# Altium schematic sheet Power_Invertor.SchDoc (part 1 of 2)
size 1200 x 800 mm; SheetNumber: 1; SheetTotal: 1
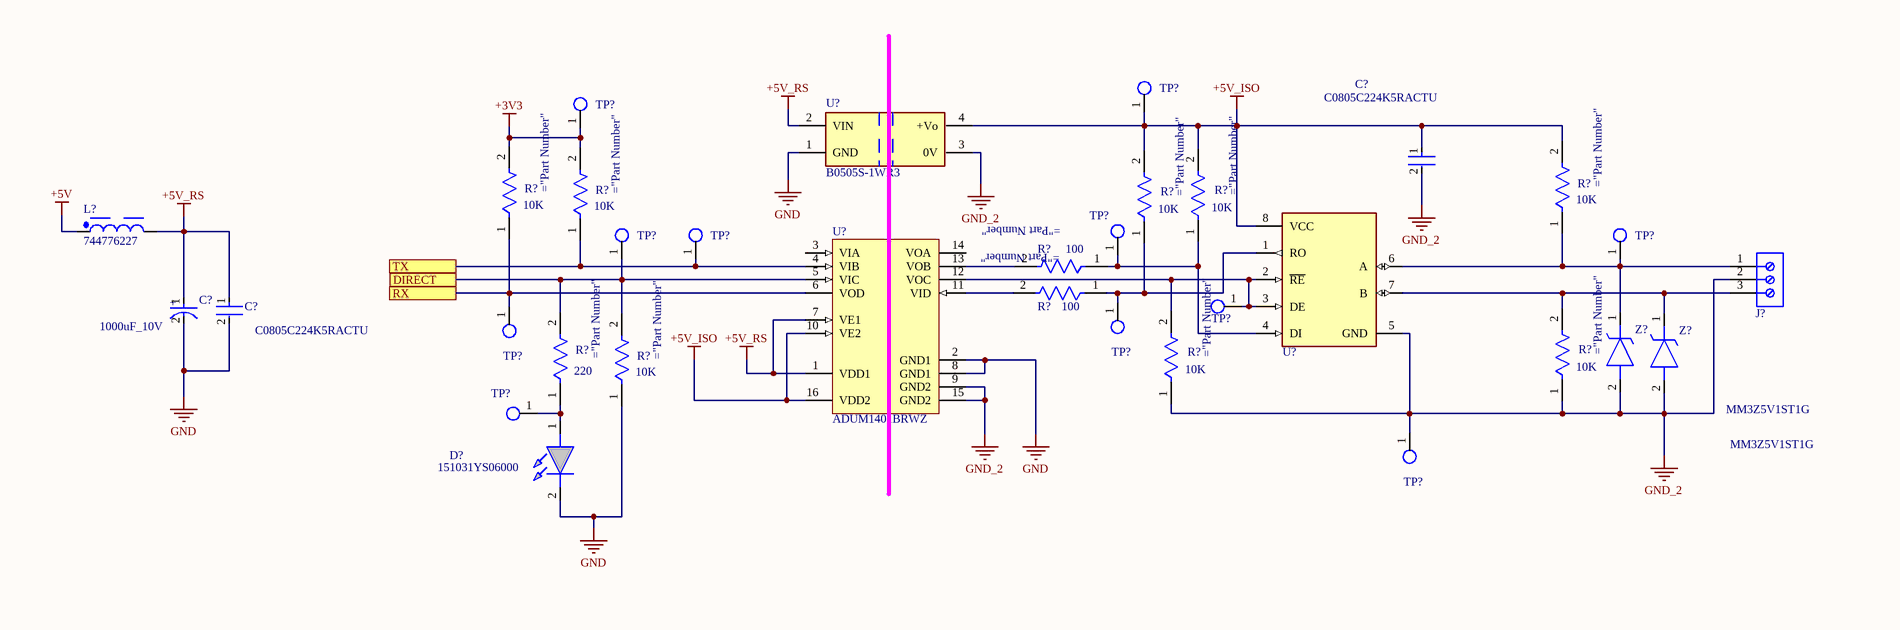
[diagram p0: Power_Invertor.SchDoc, top left]
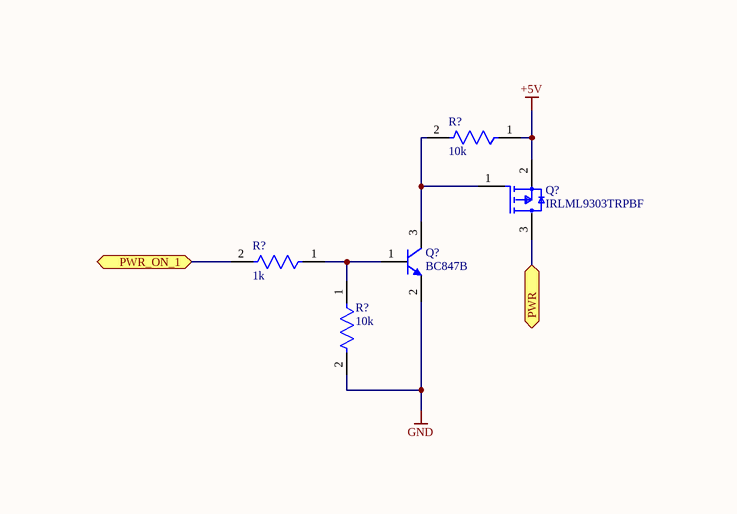
[diagram p1: Power_Invertor.SchDoc, top middle]
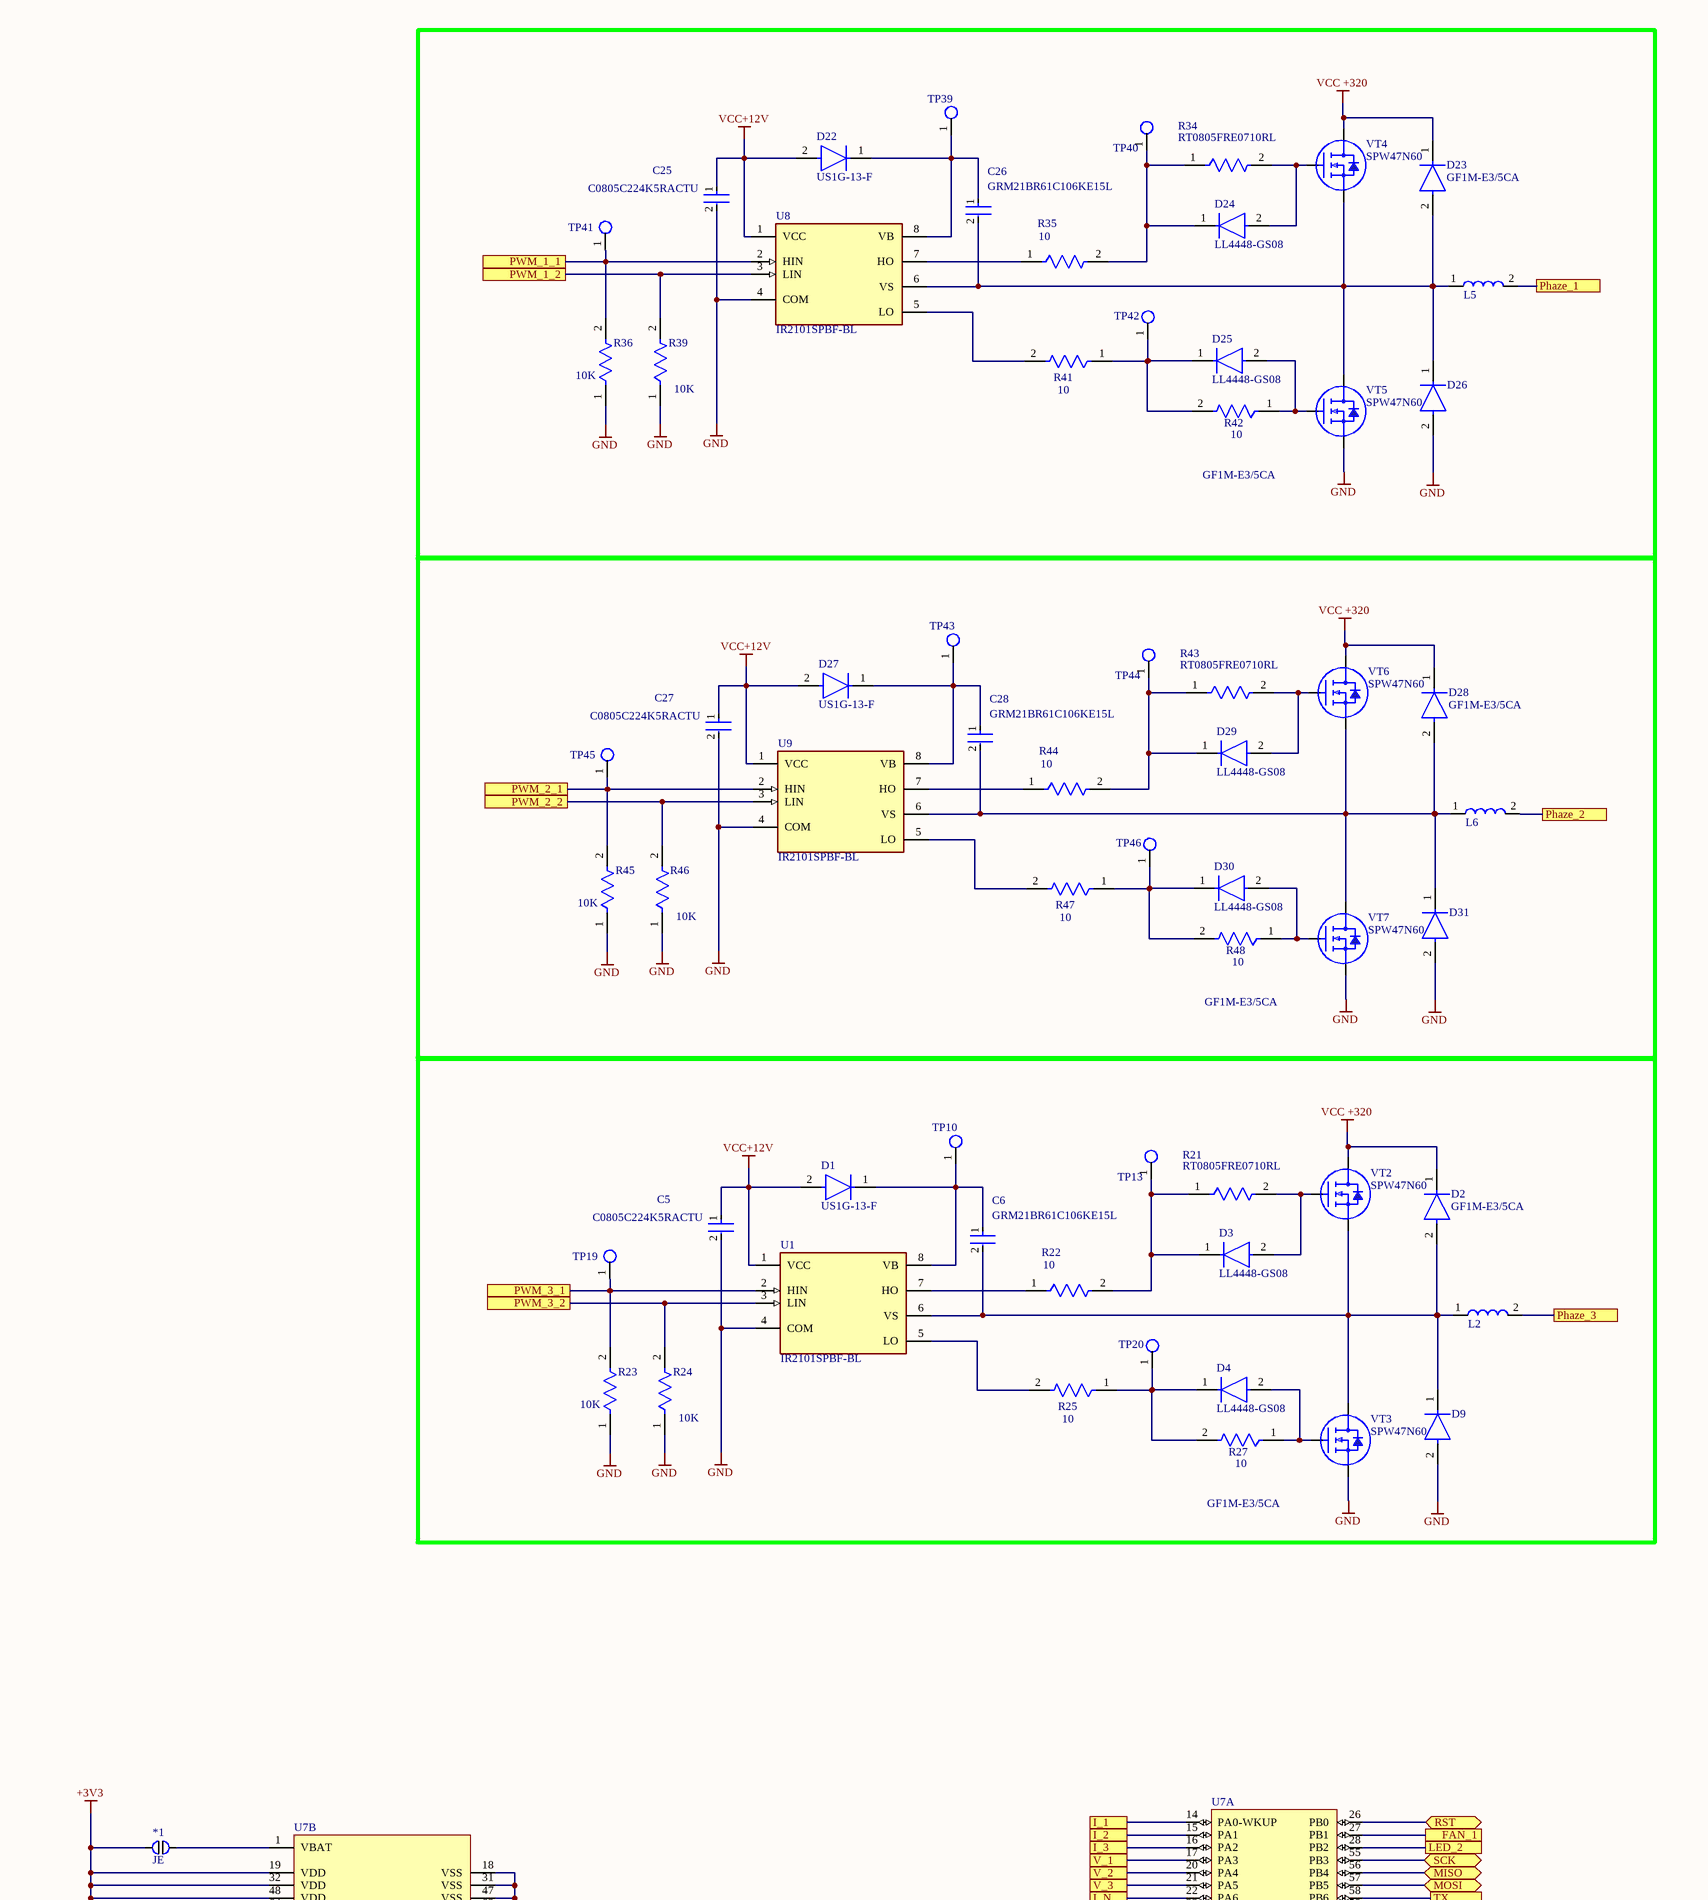
[diagram p2: Power_Invertor.SchDoc, top right]
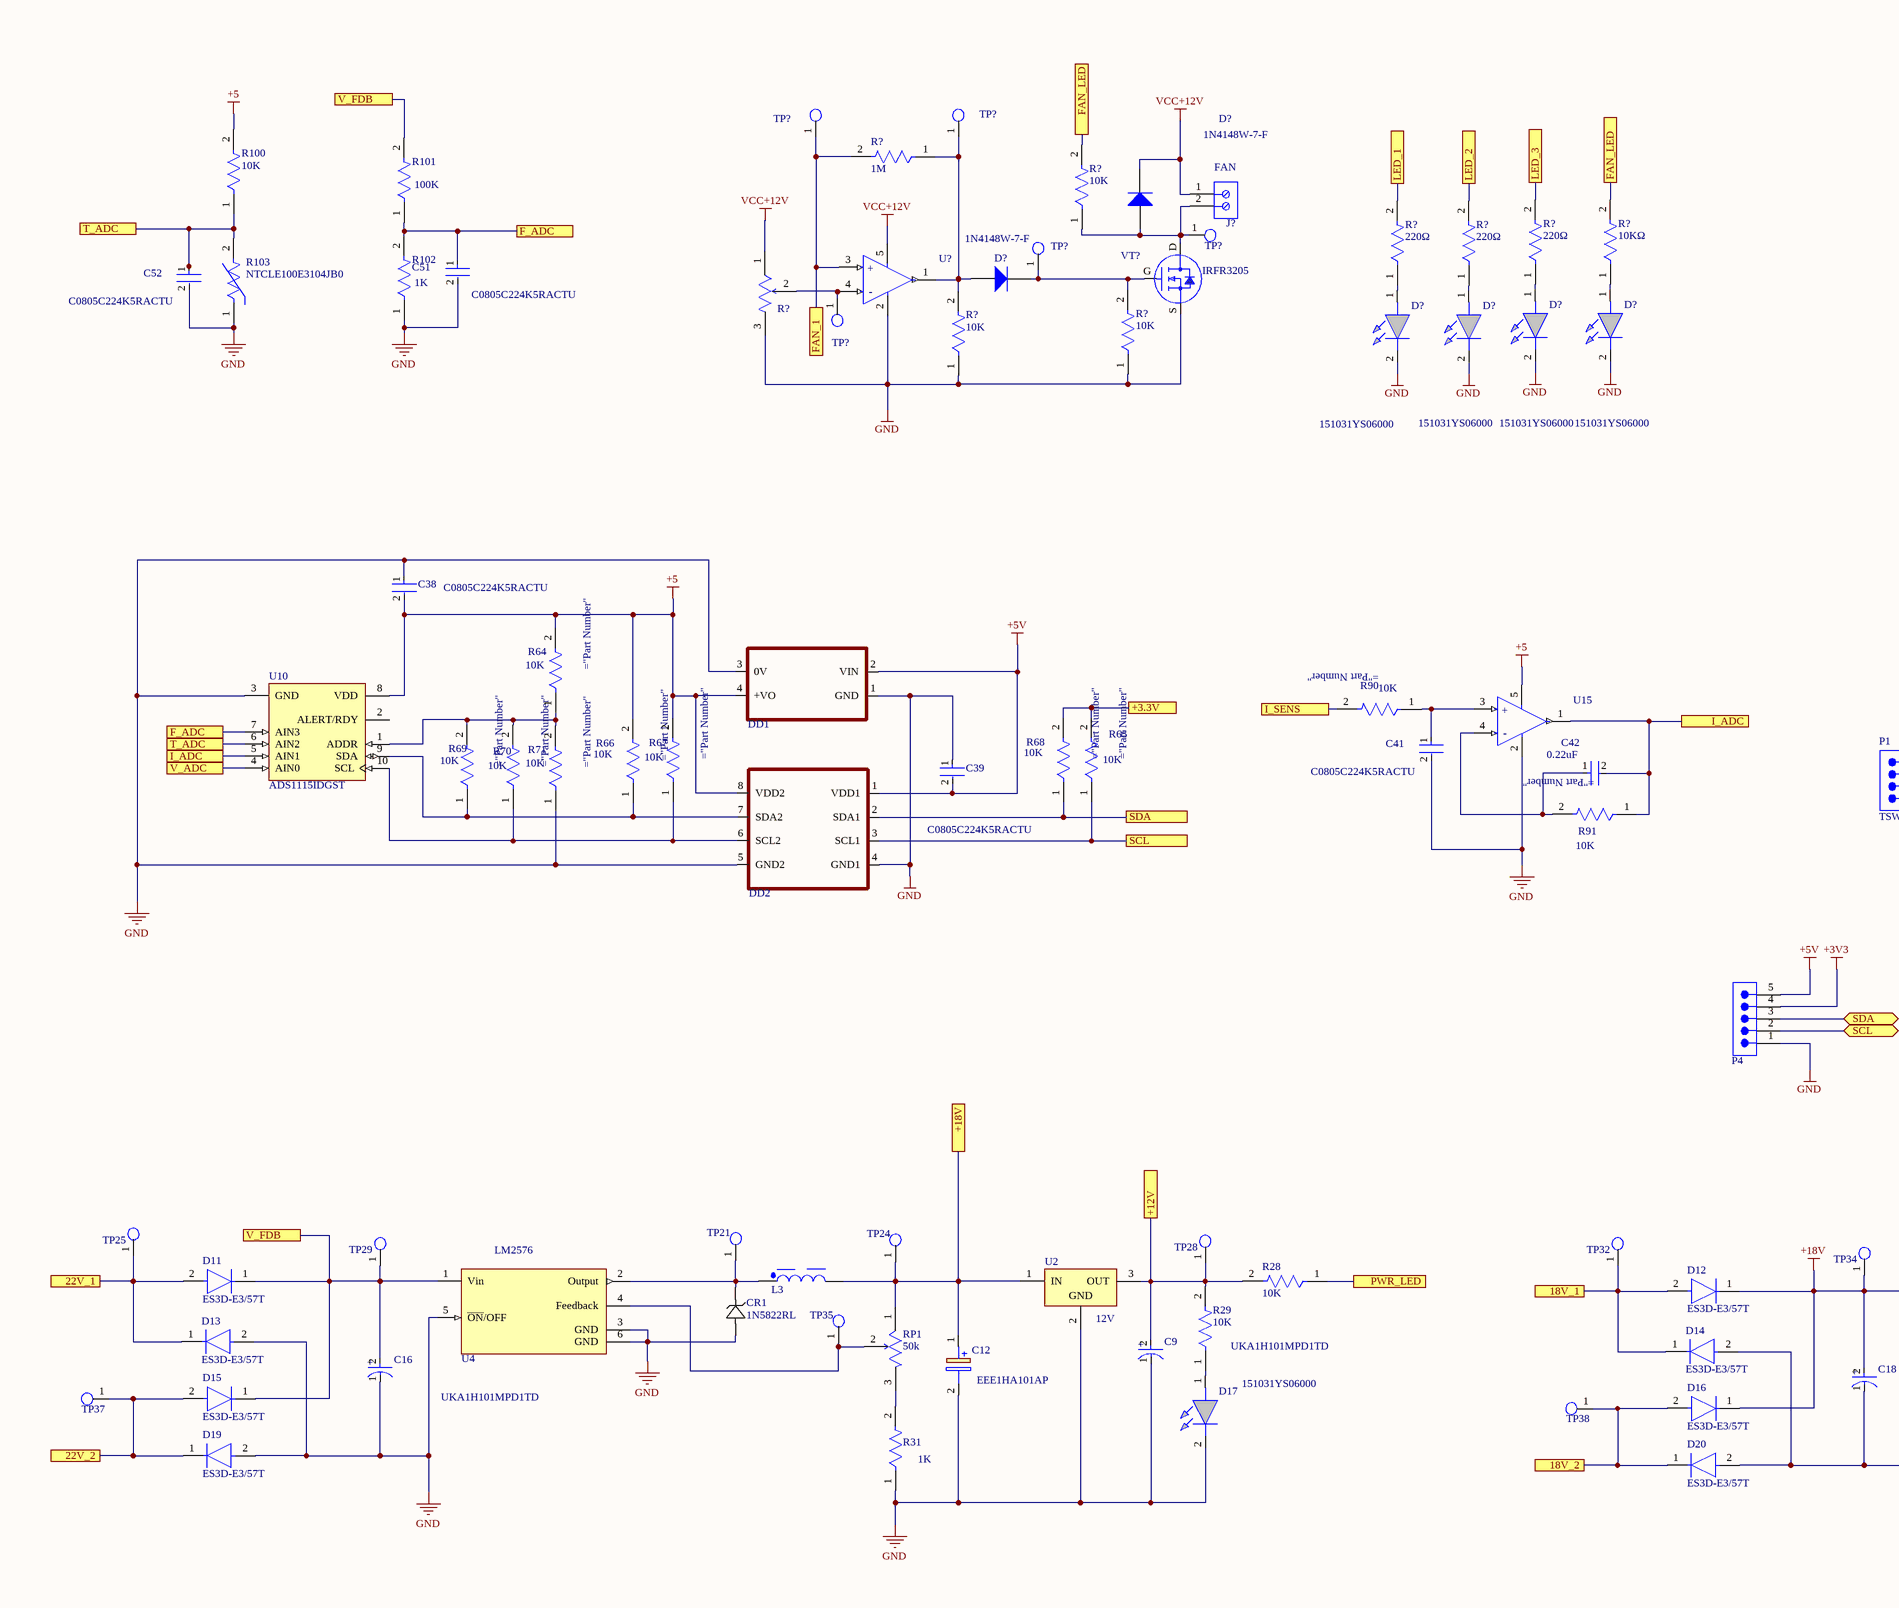
[diagram p3: Power_Invertor.SchDoc, bottom left]
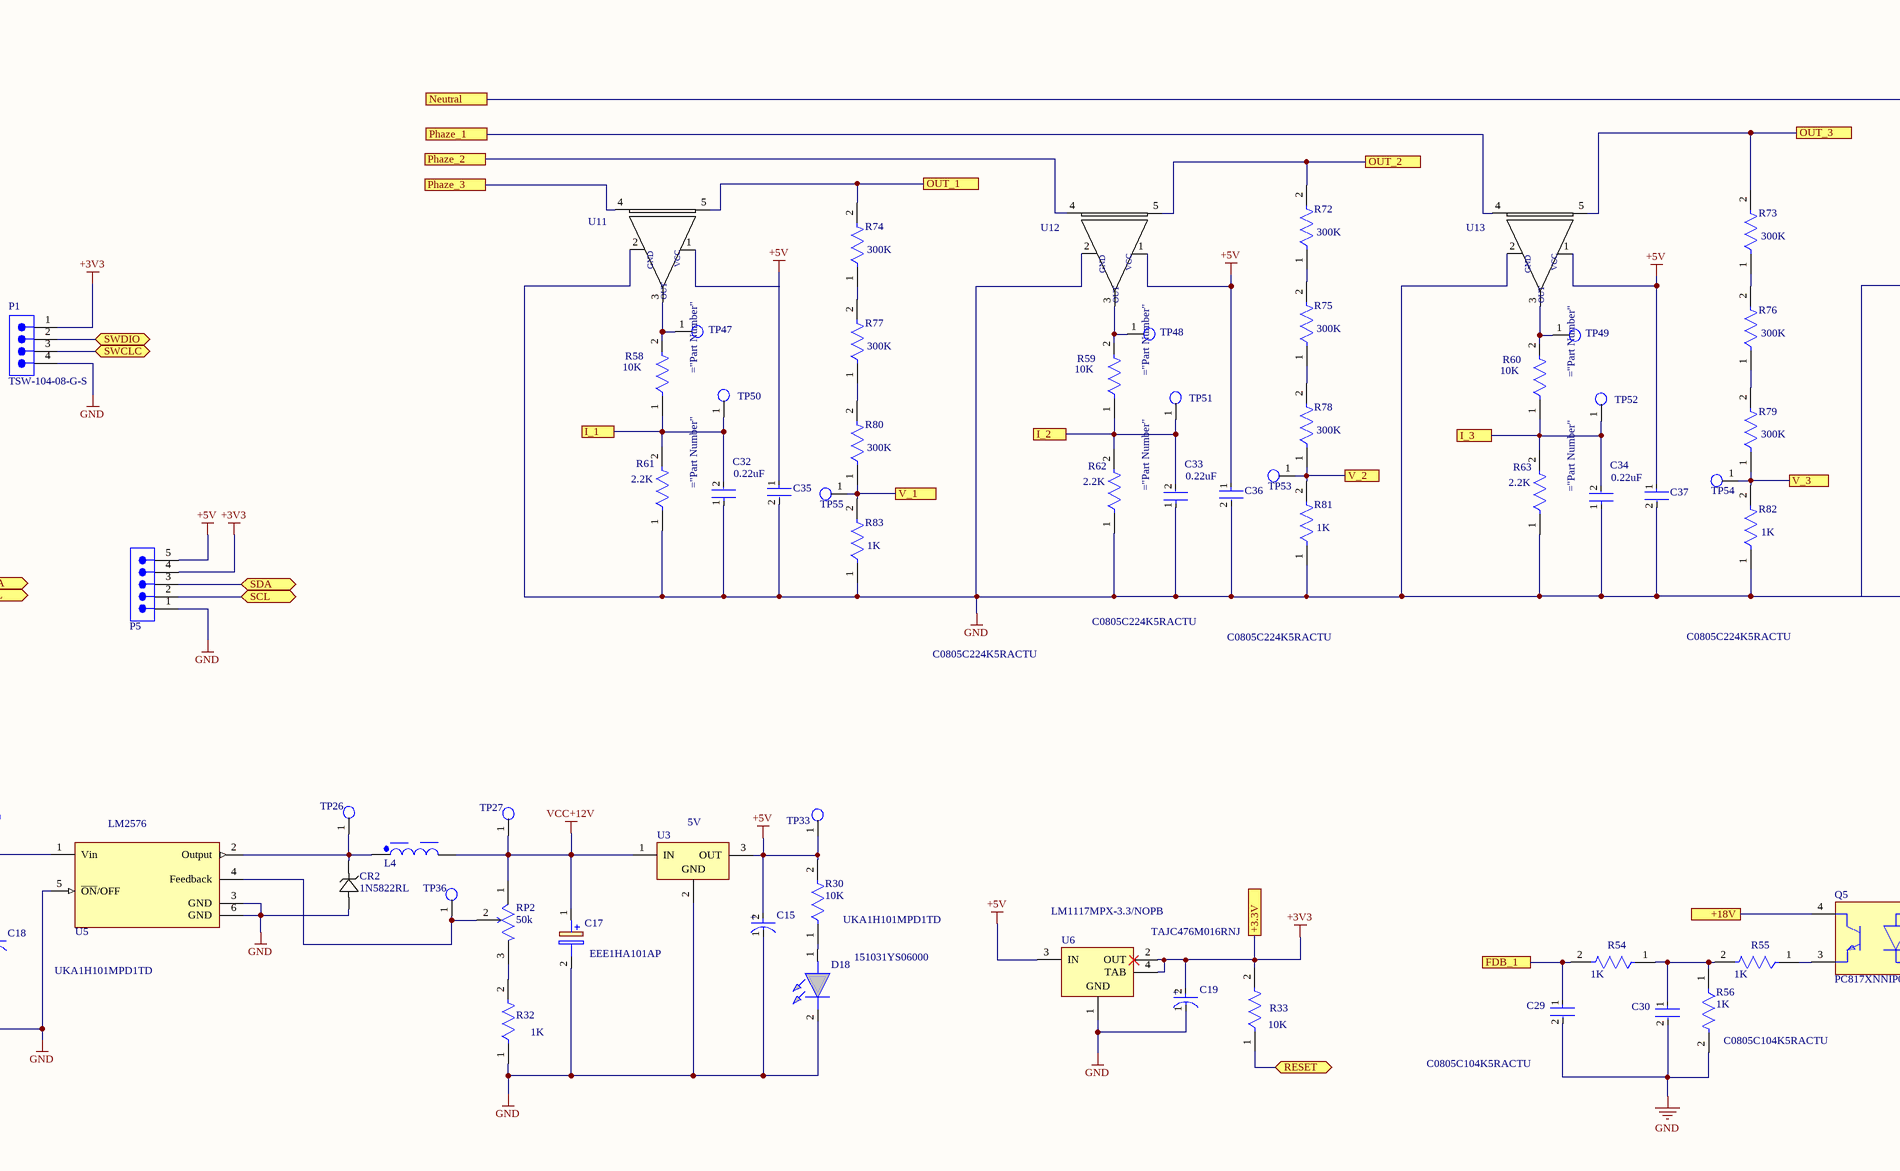
[diagram p4: Power_Invertor.SchDoc, bottom middle]
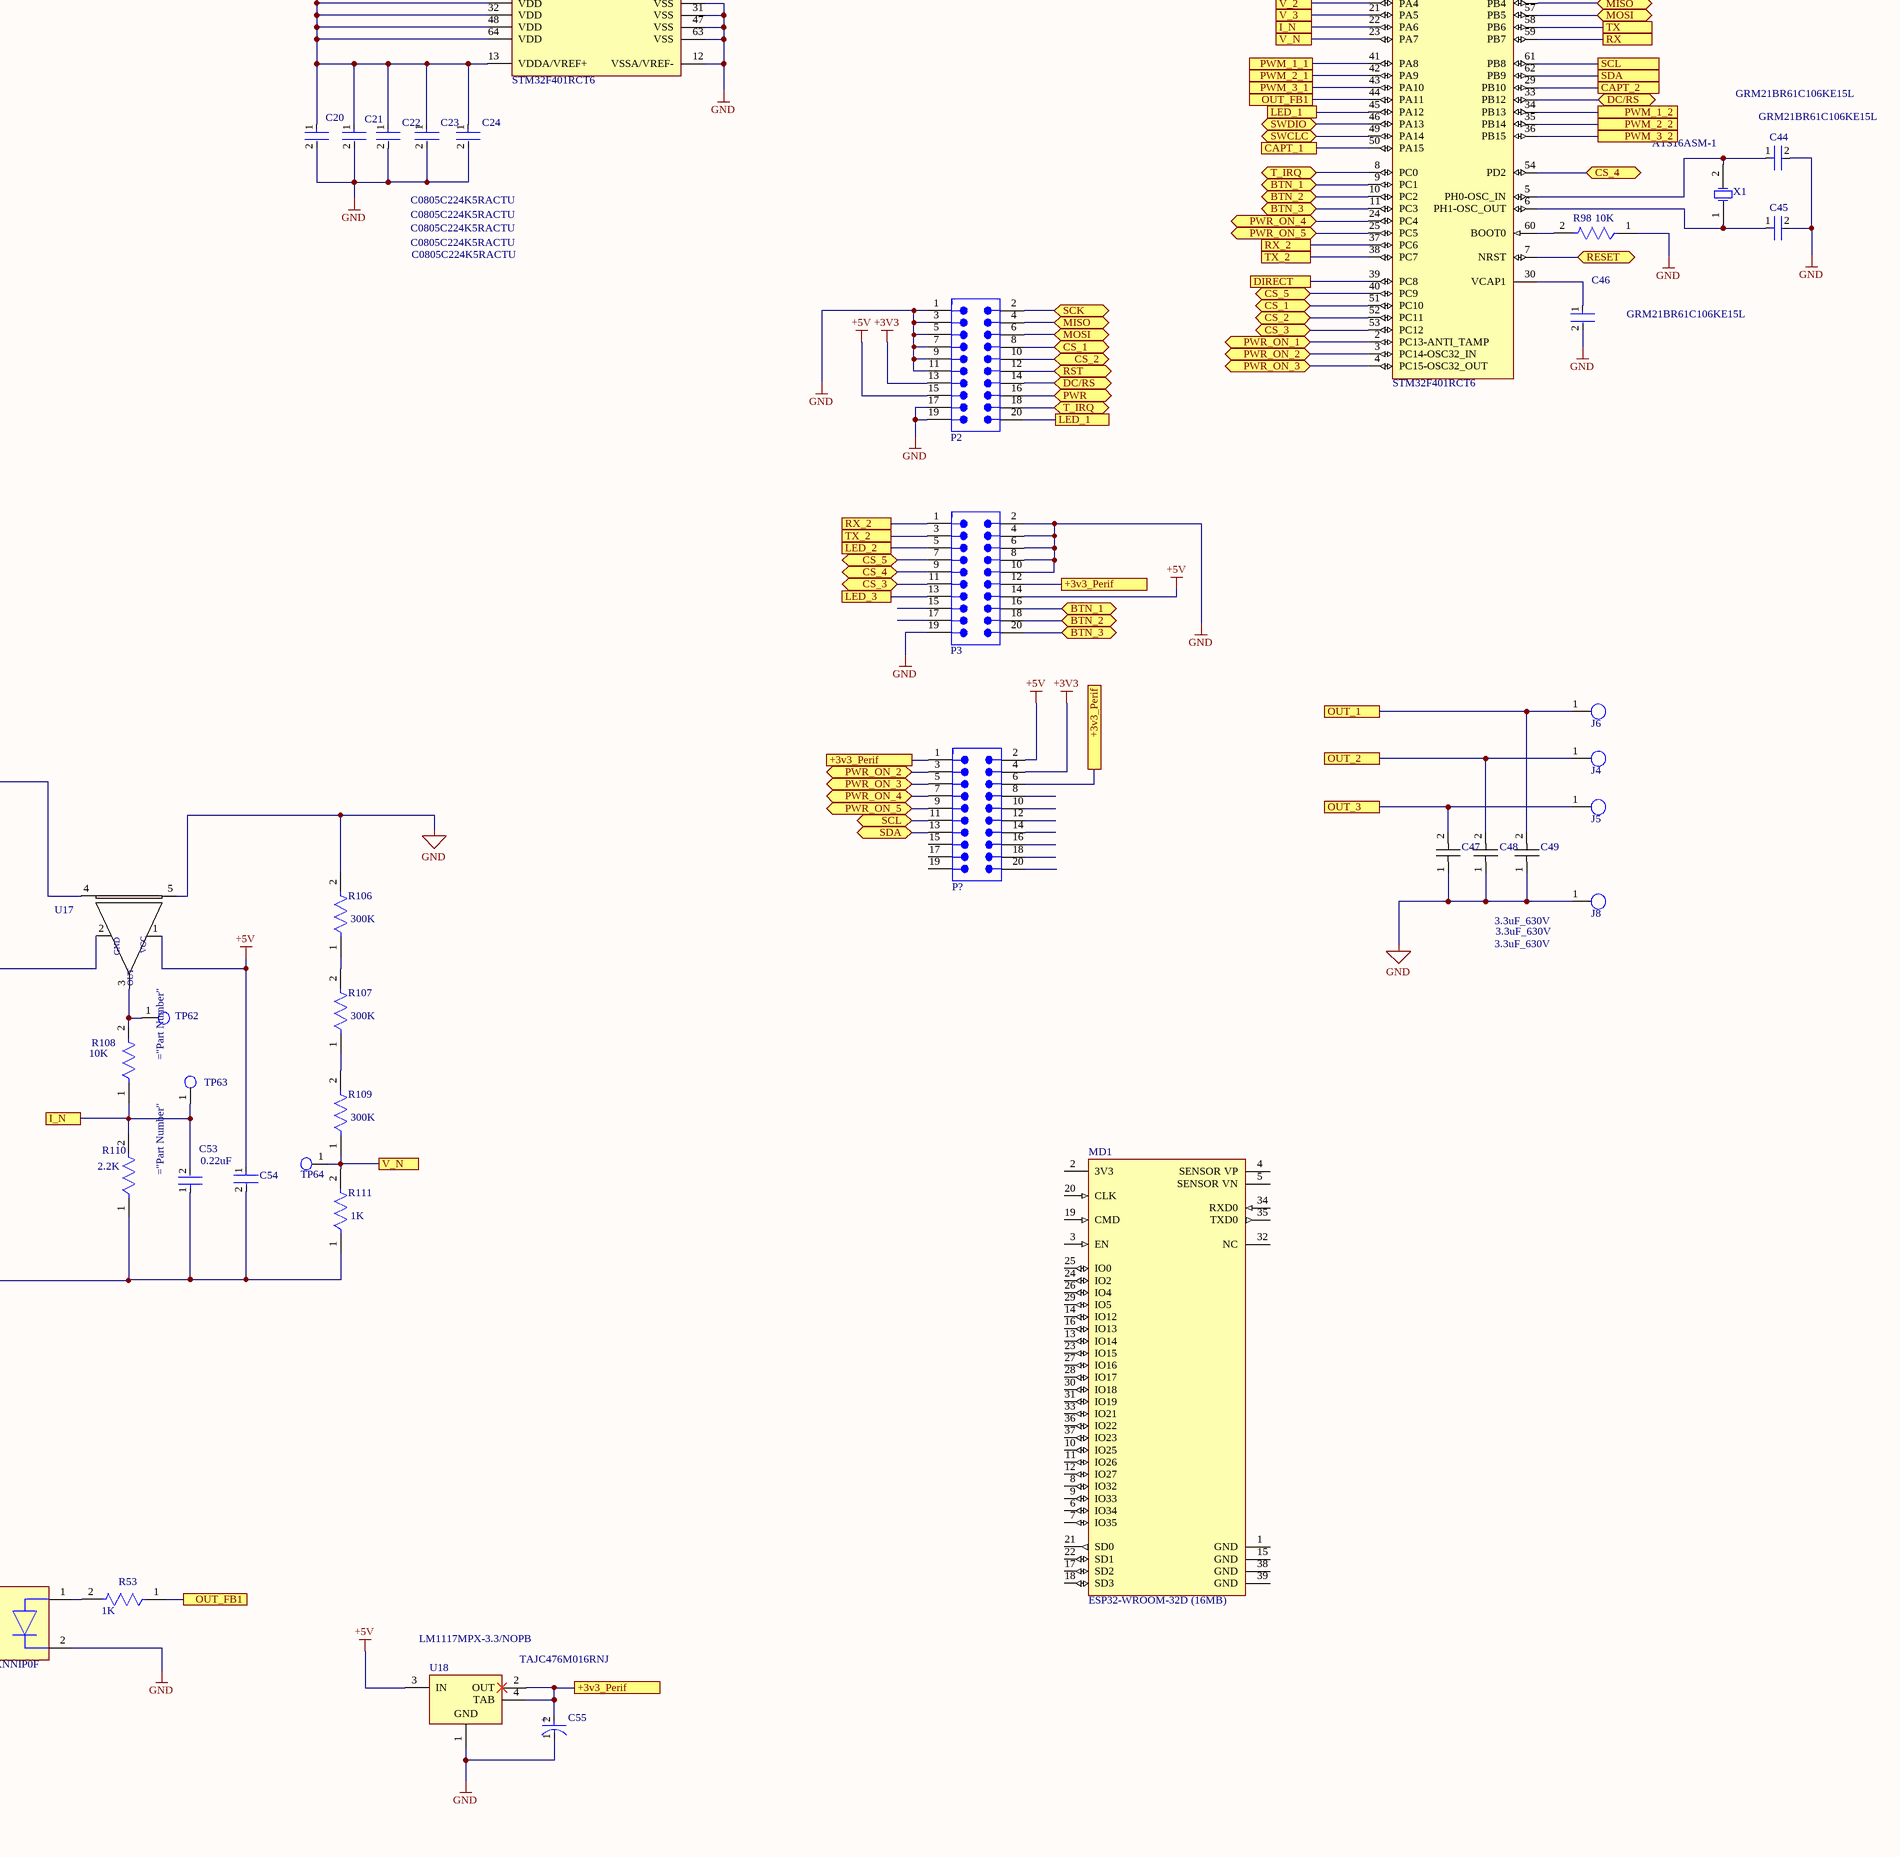
[diagram p5: Power_Invertor.SchDoc, bottom right]

## Parts
(Parts that share a designator on the sheet are numbered #1, #2 ... from top to bottom, then left to right.)
*1  JE  [JE]
C5  C0805C224K5RACTU  [FP-C0805C-DN-MFG]
C6  GRM21BR61C106KE15L  [FP-GRM21B-0_1-IPC_C]
C9  UKA1H101MPD1TD  [FP-UKA1H101MPD1TD-MFG]
C12  EEE1HA101AP  [EEEFK1V331P]
C15  UKA1H101MPD1TD  [FP-UKA1H101MPD1TD-MFG]
C16  UKA1H101MPD1TD  [FP-UKA1H101MPD1TD-MFG]
C17  EEE1HA101AP  [EEEFK1V331P]
C18  UKA1H101MPD1TD  [FP-UKA1H101MPD1TD-MFG]
C19  TAJC476M016RNJ  [FP-TAJC-MFG]
C20  C0805C224K5RACTU  [FP-C0805C-DN-IPC_A]
C21  C0805C224K5RACTU  [FP-C0805C-DN-IPC_A]
C22  C0805C224K5RACTU  [FP-C0805C-DN-IPC_A]
C23  C0805C224K5RACTU  [FP-C0805C-DN-IPC_A]
C24  C0805C224K5RACTU  [FP-C0805C-DN-IPC_A]
C25  C0805C224K5RACTU  [FP-C0805C-DN-MFG]
C26  GRM21BR61C106KE15L  [FP-GRM21B-0_1-IPC_C]
C27  C0805C224K5RACTU  [FP-C0805C-DN-MFG]
C28  GRM21BR61C106KE15L  [FP-GRM21B-0_1-IPC_C]
C29  C0805C104K5RACTU  [FP-C0805C-DN-MFG]
C30  C0805C104K5RACTU  [FP-C0805C-DN-MFG]
C32  0.22uF  [FP-C0805C-DN-MFG]
C33  0.22uF  [FP-C0805C-DN-MFG]
C34  0.22uF  [FP-C0805C-DN-MFG]
C35  C0805C224K5RACTU  [FP-C0805C-DN-MFG]
C36  C0805C224K5RACTU  [FP-C0805C-DN-MFG]
C37  C0805C224K5RACTU  [FP-C0805C-DN-MFG]
C38  C0805C224K5RACTU  [FP-C0805C-DN-MFG]
C39  C0805C224K5RACTU  [FP-C0805C-DN-MFG]
C41  C0805C224K5RACTU  [FP-C0805C-DN-MFG]
C42  0.22uF  [FP-C0805C-DN-MFG]
C44  GRM21BR61C106KE15L  [FP-GRM21B-0_1-IPC_C]
C45  GRM21BR61C106KE15L  [FP-GRM21B-0_1-IPC_C]
C46  GRM21BR61C106KE15L  [FP-GRM21B-0_1-IPC_C]
C47  3.3uF_630V  [CAP_3.3uF_630V]
C48  3.3uF_630V  [CAP_3.3uF_630V]
C49  3.3uF_630V  [CAP_3.3uF_630V]
C51  C0805C224K5RACTU  [FP-C0805C-DN-MFG]
C52  C0805C224K5RACTU  [FP-C0805C-DN-MFG]
C53  0.22uF  [FP-C0805C-DN-MFG]
C54  C0805C224K5RACTU  [FP-C0805C-DN-MFG]
C55  TAJC476M016RNJ  [FP-TAJC-MFG]
C?#1  C0805C224K5RACTU  [FP-C0805C-DN-MFG]
C?#2  C0805C224K5RACTU  [FP-C0805C-DN-MFG]
C?#3  1000uF_10V  [1000uF_10V_Size_F]
CR1  1N5822RL  [DO-201AD_STM]
CR2  1N5822RL  [DO-201AD_STM]
D1  US1G-13-F  [FP-SMA-MFG]
D2  GF1M-E3/5CA  [FP-GF1M-E3-5CA-MFG]
D3  LL4448-GS08  [FP-6_560-5005_01-4-MFG]
D4  LL4448-GS08  [FP-6_560-5005_01-4-MFG]
D9  GF1M-E3/5CA  [FP-GF1M-E3-5CA-MFG]
D11  ES3D-E3/57T  [FP-95402-MFG]
D12  ES3D-E3/57T  [FP-95402-MFG]
D13  ES3D-E3/57T  [FP-95402-MFG]
D14  ES3D-E3/57T  [FP-95402-MFG]
D15  ES3D-E3/57T  [FP-95402-MFG]
D16  ES3D-E3/57T  [FP-95402-MFG]
D17  151031YS06000  [LED_BLUE]
D18  151031YS06000  [LED_BLUE]
D19  ES3D-E3/57T  [FP-95402-MFG]
D20  ES3D-E3/57T  [FP-95402-MFG]
D22  US1G-13-F  [FP-SMA-MFG]
D23  GF1M-E3/5CA  [FP-GF1M-E3-5CA-MFG]
D24  LL4448-GS08  [FP-6_560-5005_01-4-MFG]
D25  LL4448-GS08  [FP-6_560-5005_01-4-MFG]
D26  GF1M-E3/5CA  [FP-GF1M-E3-5CA-MFG]
D27  US1G-13-F  [FP-SMA-MFG]
D28  GF1M-E3/5CA  [FP-GF1M-E3-5CA-MFG]
D29  LL4448-GS08  [FP-6_560-5005_01-4-MFG]
D30  LL4448-GS08  [FP-6_560-5005_01-4-MFG]
D31  GF1M-E3/5CA  [FP-GF1M-E3-5CA-MFG]
D?#1  151031YS06000  [LED_BLUE]
D?#2  1N4148W-7-F  [DIOD-SOD123-2_V]
D?#3  1N4148W-7-F  [DIOD-SOD123-2_V]
D?#4  151031YS06000  [LED_BLUE]
D?#5  151031YS06000  [LED_BLUE]
D?#6  151031YS06000  [LED_BLUE]
D?#7  151031YS06000  [LED_BLUE]
DD1  B0505S-1W  [PLS-4-2.54mm]  (value not drawn)
DD2  ADUM1250ARZ  [SO8-150]  (value not drawn)
J4  KLS8-M3  [KLS8-M3]  (value not drawn)
J5  KLS8-M3  [KLS8-M3]  (value not drawn)
J6  KLS8-M3  [KLS8-M3]  (value not drawn)
J8  KLS8-M3  [KLS8-M3]  (value not drawn)
J?#1  691101710003  [691101710003]  (value not drawn)
J?#2  691137710002  [691137710002]  (value not drawn)
L2  Coil  [Coil_drosel]  (value not drawn)
L3  22µH, 2.04A  [WE-PD2_1054]  (value not drawn)
L4  22µH, 2.04A  [WE-PD2_1054]  (value not drawn)
L5  Coil  [Coil_drosel]  (value not drawn)
L6  Coil  [Coil_drosel]  (value not drawn)
L?  744776227  [WE-PD2_1054]
MD1  ESP32-WROOM-32D (16MB)  [FP-ESP32-WROOM-32D_16MB-MFG]
P1  TSW-104-08-G-S  [SMTC-TSW-104-08-X-S]
P2  62702021621  [62702021621]  (value not drawn)
P3  62702021621  [62702021621]  (value not drawn)
P4  61300511121  [61300511121]  (value not drawn)
P5  61300511121  [61300511121]  (value not drawn)
P?  62702021621  [62702021621]  (value not drawn)
Q5  PC817XNNIP0F  [FP-PC817XNNIP0F-MFG]
Q?#1  IRLML9303TRPBF  [FP-Micro3-MFG]
Q?#2  BC847B  [INF-SOT23_M]
R21  RT0805FRE0710RL  [FP-RT0805-IPC_C]
R22  10  [FP-RT0805-MFG]
R23  10K  [FP-CRCW0805-e3-IPC_A]
R24  10K  [FP-CRCW0805-e3-IPC_A]
R25  10  [Vishay_CRCW0805-e3_IPC_A]
R27  10  [FP-CRCW0805-e3-IPC_B]
R28  10K  [FP-CRCW0805-e3-MFG]
R29  10K  [FP-CRCW0805-e3-MFG]
R30  10K  [FP-CRCW0805-e3-MFG]
R31  1K  [Vishay_CRCW0805-e3_IPC_C]
R32  1K  [Vishay_CRCW0805-e3_IPC_C]
R33  10K  [Vishay_CRCW0805-e3_IPC_A]
R34  RT0805FRE0710RL  [FP-RT0805-IPC_C]
R35  10  [FP-RT0805-MFG]
R36  10K  [FP-CRCW0805-e3-IPC_A]
R39  10K  [FP-CRCW0805-e3-IPC_A]
R41  10  [Vishay_CRCW0805-e3_IPC_A]
R42  10  [FP-CRCW0805-e3-IPC_B]
R43  RT0805FRE0710RL  [FP-RT0805-IPC_C]
R44  10  [FP-RT0805-MFG]
R45  10K  [FP-CRCW0805-e3-IPC_A]
R46  10K  [FP-CRCW0805-e3-IPC_A]
R47  10  [Vishay_CRCW0805-e3_IPC_A]
R48  10  [FP-CRCW0805-e3-IPC_B]
R53  1K  [Vishay_CRCW0805-e3_IPC_C]
R54  1K  [Vishay_CRCW0805-e3_IPC_C]
R55  1K  [Vishay_CRCW0805-e3_IPC_C]
R56  1K  [Vishay_CRCW0805-e3_IPC_C]
R58  10K  [Vishay_CRCW0805-e3_IPC_A]
R59  10K  [Vishay_CRCW0805-e3_IPC_A]
R60  10K  [Vishay_CRCW0805-e3_IPC_A]
R61  2.2K  [Vishay_CRCW0805-e3_IPC_A]
R62  2.2K  [Vishay_CRCW0805-e3_IPC_A]
R63  2.2K  [Vishay_CRCW0805-e3_IPC_A]
R64  10K  [Vishay_CRCW0805-e3_IPC_A]
R65  10K  [Vishay_CRCW0805-e3_IPC_A]
R66  10K  [Vishay_CRCW0805-e3_IPC_A]
R67  10K  [Vishay_CRCW0805-e3_IPC_A]
R68  10K  [Vishay_CRCW0805-e3_IPC_A]
R69  10K  [Vishay_CRCW0805-e3_IPC_A]
R70  10K  [Vishay_CRCW0805-e3_IPC_A]
R71  10K  [Vishay_CRCW0805-e3_IPC_A]
R72  300K  [FP-CRCW1210-e3-IPC_A]
R73  300K  [FP-CRCW1210-e3-IPC_A]
R74  300K  [FP-CRCW1210-e3-IPC_A]
R75  300K  [FP-CRCW1210-e3-IPC_A]
R76  300K  [FP-CRCW1210-e3-IPC_A]
R77  300K  [FP-CRCW1210-e3-IPC_A]
R78  300K  [FP-CRCW1210-e3-IPC_A]
R79  300K  [FP-CRCW1210-e3-IPC_A]
R80  300K  [FP-CRCW1210-e3-IPC_A]
R81  1K  [FP-CRCW1210-e3-IPC_A]
R82  1K  [FP-CRCW1210-e3-IPC_A]
R83  1K  [FP-CRCW1210-e3-IPC_A]
R90  10K  [Yageo_RC0805_IPC_C]
R91  10K  [Yageo_RC0805_IPC_C]
R98  10K  [Vishay_CRCW0805-e3_IPC_A]
R100  10K  [FP-CRCW0805-e3-MFG]
R101  100K  [FP-CRCW1210-e3-IPC_A]
R102  1K  [FP-CRCW1210-e3-IPC_A]
R103  NTCLE100E3104JB0  [FP-NTCLE100E3104JB0-MFG]
R106  300K  [FP-CRCW1210-e3-IPC_A]
R107  300K  [FP-CRCW1210-e3-IPC_A]
R108  10K  [Vishay_CRCW0805-e3_IPC_A]
R109  300K  [FP-CRCW1210-e3-IPC_A]
R110  2.2K  [Vishay_CRCW0805-e3_IPC_A]
R111  1K  [FP-CRCW1210-e3-IPC_A]
R?#1  10K  [Vishay_CRCW0805-e3_IPC_A]
R?#2  10K  [Vishay_CRCW0805-e3_IPC_A]
R?#3  10K  [Vishay_CRCW0805-e3_IPC_A]
R?#4  10K  [Yageo_RC0805_IPC_A]
R?#5  10K  [Yageo_RC0805_IPC_A]
R?#6  100  [Yageo_RC0805_IPC_A]
R?#7  100  [Yageo_RC0805_IPC_A]
R?#8  220  [Yageo_RC0805_IPC_A]
R?#9  10K  [Yageo_RC0805_IPC_A]
R?#10  10K  [Yageo_RC0805_IPC_A]
R?#11  10K  [Vishay_CRCW0805-e3_IPC_A]
R?#12  10k  [Vishay_CRCW0805-e3_IPC_A]
R?#13  1k  [Vishay_CRCW0805-e3_IPC_A]
R?#14  10k  [Vishay_CRCW0805-e3_IPC_A]
R?#15  1M  [FP-CRCW0805-e3-MFG]
R?#16  10K  [FP-CRCW0805-e3-MFG]
R?#17  3296W-1-202LF  [Bourns_3296W_MFG]  (value not drawn)
R?#18  220Ω  [FP-CRCW0805-e3-MFG]
R?#19  220Ω  [FP-CRCW0805-e3-MFG]
R?#20  220Ω  [FP-CRCW0805-e3-MFG]
R?#21  10KΩ  [FP-CRCW0805-e3-MFG]
R?#22  10K  [FP-CRCW0805-e3-MFG]
R?#23  10K  [FP-CRCW0805-e3-MFG]
RP1  50k  [Bourns_3296W_MFG]
RP2  50k  [Bourns_3296W_MFG]
TP10  Test_Point_PCB  [Test_Point]  (value not drawn)
TP13  Test_Point_PCB  [Test_Point]  (value not drawn)
TP19  Test_Point_PCB  [Test_Point]  (value not drawn)
TP20  Test_Point_PCB  [Test_Point]  (value not drawn)
TP21  Test_Point_PCB  [Test_Point]  (value not drawn)
TP24  Test_Point_PCB  [Test_Point]  (value not drawn)
TP25  Test_Point_PCB  [Test_Point]  (value not drawn)
TP26  Test_Point_PCB  [Test_Point]  (value not drawn)
TP27  Test_Point_PCB  [Test_Point]  (value not drawn)
TP28  Test_Point_PCB  [Test_Point]  (value not drawn)
TP29  Test_Point_PCB  [Test_Point]  (value not drawn)
TP32  Test_Point_PCB  [Test_Point]  (value not drawn)
TP33  Test_Point_PCB  [Test_Point]  (value not drawn)
TP34  Test_Point_PCB  [Test_Point]  (value not drawn)
TP35  Test_Point_PCB  [Test_Point]  (value not drawn)
TP36  Test_Point_PCB  [Test_Point]  (value not drawn)
TP37  Test_Point_PCB  [Test_Point]  (value not drawn)
TP38  Test_Point_PCB  [Test_Point]  (value not drawn)
TP39  Test_Point_PCB  [Test_Point]  (value not drawn)
TP40  Test_Point_PCB  [Test_Point]  (value not drawn)
TP41  Test_Point_PCB  [Test_Point]  (value not drawn)
TP42  Test_Point_PCB  [Test_Point]  (value not drawn)
TP43  Test_Point_PCB  [Test_Point]  (value not drawn)
TP44  Test_Point_PCB  [Test_Point]  (value not drawn)
TP45  Test_Point_PCB  [Test_Point]  (value not drawn)
TP46  Test_Point_PCB  [Test_Point]  (value not drawn)
TP47  Test_Point_PCB  [Test_Point]  (value not drawn)
TP48  Test_Point_PCB  [Test_Point]  (value not drawn)
TP49  Test_Point_PCB  [Test_Point]  (value not drawn)
TP50  Test_Point_PCB  [Test_Point]  (value not drawn)
TP51  Test_Point_PCB  [Test_Point]  (value not drawn)
TP52  Test_Point_PCB  [Test_Point]  (value not drawn)
TP53  Test_Point_PCB  [Test_Point]  (value not drawn)
TP54  Test_Point_PCB  [Test_Point]  (value not drawn)
TP55  Test_Point_PCB  [Test_Point]  (value not drawn)
TP62  Test_Point_PCB  [Test_Point]  (value not drawn)
TP63  Test_Point_PCB  [Test_Point]  (value not drawn)
TP64  Test_Point_PCB  [Test_Point]  (value not drawn)
TP?#1  Test_Point_PCB  [Test_Point]  (value not drawn)
TP?#2  Test_Point_PCB  [Test_Point]  (value not drawn)
TP?#3  Test_Point_PCB  [Test_Point]  (value not drawn)
TP?#4  Test_Point_PCB  [Test_Point]  (value not drawn)
TP?#5  Test_Point_PCB  [Test_Point]  (value not drawn)
TP?#6  Test_Point_PCB  [Test_Point]  (value not drawn)
TP?#7  Test_Point_PCB  [Test_Point]  (value not drawn)
TP?#8  Test_Point_PCB  [Test_Point]  (value not drawn)
TP?#9  Test_Point_PCB  [Test_Point]  (value not drawn)
TP?#10  Test_Point_PCB  [Test_Point]  (value not drawn)
TP?#11  Test_Point_PCB  [Test_Point]  (value not drawn)
TP?#12  Test_Point_PCB  [Test_Point]  (value not drawn)
TP?#13  Test_Point_PCB  [Test_Point]  (value not drawn)
TP?#14  Test_Point_PCB  [Test_Point]  (value not drawn)
TP?#15  Test_Point_PCB  [Test_Point]  (value not drawn)
TP?#16  Test_Point_PCB  [Test_Point]  (value not drawn)
U1  IR2101SPBF-BL  [FP-PG-DSO-8-IPC_B]
U2  12V  [TO-220_Bended_Rad]
U3  5V  [TO-220_Bended_Rad]
U4  LM2576  [ON_Semiconductor_936A-02_MFG]
U5  LM2576  [ON_Semiconductor_936A-02_MFG]
U6  LM1117MPX-3.3/NOPB  [DCY0004A_L]
U7  STM32F401RCT6  [STM-LQFP64_M]  (parts A,B of 2)
U8  IR2101SPBF-BL  [FP-PG-DSO-8-IPC_B]
U9  IR2101SPBF-BL  [FP-PG-DSO-8-IPC_B]
U10  ADS1115IDGST  [TI-DGS10_N]
U11  ACS758  [ACS758-100]  (value not drawn)
U12  ACS758  [ACS758-100]  (value not drawn)
U13  ACS758  [ACS758-100]  (value not drawn)
U15  MCP6001  [SOT-23-5]  (value not drawn)
U17  ACS758  [ACS758-100]  (value not drawn)
U18  LM1117MPX-3.3/NOPB  [DCY0004A_L]
U?#1  B0505S-1WR3  [FP-B0505S-1WR3-MFG]
U?#2  MAX485ECSA+  [SOIC127P600X175-8N]  (value not drawn)
U?#3  ADUM1401BRWZ  [ADI-RW-16_M]
U?#4  MCP6001  [SOT-23-5]  (value not drawn)
VT2  SPW47N60  [TO-220(bend2)]
VT3  SPW47N60  [TO-220(bend2)]
VT4  SPW47N60  [TO-220(bend2)]
VT5  SPW47N60  [TO-220(bend2)]
VT6  SPW47N60  [TO-220(bend2)]
VT7  SPW47N60  [TO-220(bend2)]
VT?  IRFR3205  [TO-220(bend2)]
X1  ATS16ASM-1  [CTS-ATS-SM-XTAL-2]
Z?#1  MM3Z5V1ST1G  [SOD2512X110N]
Z?#2  MM3Z5V1ST1G  [SOD2512X110N]

## Ports
18V_1, 18V_2, 22V_1, 22V_2, +3.3V, +3v3_Perif, +12V, +18V, BTN_1 (bidir), BTN_2 (bidir), BTN_3 (bidir), CAPT_1, CAPT_2, CS_1 (bidir), CS_2 (bidir), CS_3 (bidir), CS_4 (bidir), CS_5 (bidir), DC/RS (bidir), DIRECT, F_ADC, FAN_1, FAN_LED, FDB_1, I_1, I_2, I_3, I_ADC, I_N, I_SENS, LED_1, LED_2, LED_3, MISO (bidir), MOSI (bidir), Neutral, OUT_1, OUT_2, OUT_3, OUT_FB1, Phaze_1, Phaze_2, Phaze_3, PWM_1_1, PWM_1_2, PWM_2_1, PWM_2_2, PWM_3_1, PWM_3_2, PWR (bidir), PWR_LED, PWR_ON_1 (bidir), PWR_ON_2 (bidir), PWR_ON_3 (bidir), PWR_ON_4 (bidir), PWR_ON_5 (bidir), RESET (bidir), RST (bidir), RX, RX_2, SCK (bidir), SCL, SCL (bidir), SDA, SDA (bidir), SWCLC (bidir), SWDIO (bidir), T_ADC, T_IRQ (bidir), TX, TX_2, V_1, V_2, V_3, V_ADC, V_FDB, V_N

## Nets
+3V3: *1.1 C19.2(A) C20.1 C21.1 C22.1 C23.1 C24.1 P1.1 P2.13 P4.4 P5.4 P?.4 R33.2 R65.2 R68.2 R?#2.2 R?#3.2 TP?#2.1(G9) U6.2(OUT) U6.4(TAB) U7.13(VDDA/VREF+) U7.19(VDD) U7.32(VDD) U7.48(VDD) U7.64(VDD) ; port +3.3V
+5: C38.2 DD1.4(+VO) DD2.8(VDD2) R64.2 R66.2 R67.2 R100.2 U10.8(VDD) U15.5(VDD)
+5V: C15.2(A) C35.1 C36.1 C37.1 C39.2 C54.1 DD1.2(VIN) DD2.1(VDD1) L?.1 P2.15 P3.14 P4.5 P5.5 P?.2 Q?#1.2(S) R30.2 R?#12.1 TP33.1(G9) U3.3(OUT) U6.3(IN) U11.1(+VCC) U12.1(+VCC) U13.1(+VCC) U17.1(+VCC) U18.3(IN)
+5V_ISO: C?#1.1 R?#1.2 R?#4.2 R?#5.2 TP?#1.1(G9) U?#1.4(+Vo) U?#2.8(VCC) U?#3.10(VE2) U?#3.16(VDD2)
+5V_RS: C?#2.1 C?#3.1(+) L?.2 U?#1.2(VIN) U?#3.1(VDD1) U?#3.7(VE1)
+18V: C18.2(A) D12.1(C) D16.1(C) TP34.1(G9) U5.1(Vin)
GND: C5.2 C9.1(C) C12.2(-) C15.1(C) C16.1(C) C17.2(-) C18.1(C) C19.1(C) C20.2 C21.2 C22.2 C23.2 C24.2 C25.2 C27.2 C29.2 C30.2 C32.1 C33.1 C34.1 C35.2 C36.2 C37.2 C38.1 C39.1 C41.2 C44.2 C45.2 C46.2 C47.1 C48.1 C49.1 C51.2 C52.2 C53.1 C54.2 C55.1(C) C?#2.2 C?#3.2(-) CR1.2 CR2.2 D9.2(A) D13.2(A) D14.2(A) D17.2(K) D18.2(K) D19.2(A) D20.2(A) D26.2(A) D31.2(A) D?#1.2(K) D?#4.2(K) D?#5.2(K) D?#6.2(K) D?#7.2(K) DD1.1(GND) DD1.3(0V) DD2.4(GND1) DD2.5(GND2) J8.1 P1.4 P2.1 P2.3 P2.5 P2.7 P2.9 P2.11 P2.17 P2.19 P3.2 P3.4 P3.6 P3.8 P3.10 P3.19 P4.1 P5.1 Q5.2(C) Q?#2.2(E) R23.1 R24.1 R31.1 R32.1 R36.1 R39.1 R45.1 R46.1 R56.2 R61.1 R62.1 R63.1 R71.1 R81.1 R82.1 R83.1 R98.1 R102.1 R103.1 R106.2 R110.1 R111.1 R?#11.1 R?#14.2 R?#17.3(CW) R?#22.1 R?#23.1 U1.4(COM) U2.2(GND) U3.2(GND) U4.3(GND) U4.5(~{ON}/OFF) U4.6(GND) U5.3(GND) U5.5(~{ON}/OFF) U5.6(GND) U6.1(GND) U7.12(VSSA/VREF-) U7.18(VSS) U7.31(VSS) U7.47(VSS) U7.63(VSS) U8.4(COM) U9.4(COM) U10.3(GND) U11.2(GND) U12.2(GND) U13.2(GND) U15.2(VSS) U17.5(-IP) U18.1(GND) U?#1.1(GND) U?#3.2(GND1) U?#3.8(GND1) U?#4.2(VSS) VT3.S VT5.S VT7.S VT?.S
GND_2: C?#1.2 J?#1.2 R?#9.1 R?#10.1 TP?#11.1(G9) U?#1.3(0V) U?#2.5(GND) U?#3.9(GND2) U?#3.15(GND2) Z?#1.2(A) Z?#2.2(A)
VCC +320: D2.1(C) D23.1(C) D28.1(C) VT2.D VT4.D VT6.D
VCC+12V: C5.1 C17.1(+) C25.1 C27.1 D1.2(A) D22.2(A) D27.2(A) D?#2.2(K) J?#2.1 L4.2 R?#17.1(CCW) RP2.1(CCW) TP27.1(G9) U1.1(VCC) U3.1(IN) U8.1(VCC) U9.1(VCC) U?#4.5(VDD)
18V_1: D12.2(A) D14.1(C) TP32.1(G9) ; port 18V_1
18V_2: D16.2(A) D20.1(C) TP38.1(G9) ; port 18V_2
22V_1: D11.2(A) D13.1(C) TP25.1(G9) ; port 22V_1
22V_2: D15.2(A) D19.1(C) TP37.1(G9) ; port 22V_2
+3v3_Perif: C55.2(A) P3.12 P?.1 P?.6 U18.2(OUT) U18.4(TAB) ; port +3v3_Perif
+12V: C9.2(A) R28.2 R29.2 TP28.1(G9) U2.3(OUT) ; port +12V
+18V: C12.1(+) L3.2 Q5.4(C) RP1.1(CCW) TP24.1(G9) U2.1(IN) ; port +18V  [a separate net that carries the same name]
BTN_1: P3.16 U7.9(PC1) ; port BTN_1
BTN_2: P3.18 U7.10(PC2) ; port BTN_2
BTN_3: P3.20 U7.11(PC3) ; port BTN_3
CAPT_1: U7.50(PA15) ; port CAPT_1
CAPT_2: U7.29(PB10) ; port CAPT_2
CS_1: P2.8 U7.51(PC10) ; port CS_1
CS_2: P2.10 U7.52(PC11) ; port CS_2
CS_3: P3.11 U7.53(PC12) ; port CS_3
CS_4: P3.9 U7.54(PD2) ; port CS_4
CS_5: P3.7 U7.40(PC9) ; port CS_5
DC/RS: P2.14 U7.33(PB12) ; port DC/RS
DIRECT: R?#8.2 R?#11.2 TP?#4.1(G9) U7.39(PC8) U?#3.5(VIC) ; port DIRECT
F_ADC: C51.1 R101.1 R102.2 U10.7(AIN3) ; port F_ADC
FAN_1: R?#15.2 TP?#12.1(G9) U7.27(PB1) U?#4.3(VIN+) ; port FAN_1
FAN_LED: R?#16.2 R?#21.2 ; port FAN_LED
FDB_1: C29.1 R54.2 ; port FDB_1
I_1: C32.2 R58.1 R61.2 TP50.1(G9) U7.14(PA0-WKUP) ; port I_1
I_2: C33.2 R59.1 R62.2 TP51.1(G9) U7.15(PA1) ; port I_2
I_3: C34.2 R60.1 R63.2 TP52.1(G9) U7.16(PA2) ; port I_3
I_ADC: C42.2 R91.1 U10.5(AIN1) U15.1(VOUT) ; port I_ADC
I_N: C53.2 R108.1 R110.2 TP63.1(G9) U7.22(PA6) ; port I_N
I_SENS: R90.2 ; port I_SENS
LED_1: P2.20 R?#18.2 U7.45(PA12) ; port LED_1
LED_2: P3.5 R?#19.2 U7.28(PB2) ; port LED_2
LED_3: P3.13 R?#20.2 ; port LED_3
MISO: P2.4 U7.56(PB4) ; port MISO
MOSI: P2.6 U7.57(PB5) ; port MOSI
Neutral: U17.4(+IP) ; port Neutral
OUT_1: C49.2 J6.1 R74.2 U11.5(-IP) ; port OUT_1
OUT_2: C48.2 J4.1 R72.2 U12.5(-IP) ; port OUT_2
OUT_3: C47.2 J5.1 R73.2 U13.5(-IP) ; port OUT_3
OUT_FB1: R53.1 U7.44(PA11) ; port OUT_FB1
Phaze_1: L5.2 U13.4(+IP) ; port Phaze_1
Phaze_2: L6.2 U12.4(+IP) ; port Phaze_2
Phaze_3: L2.2 U11.4(+IP) ; port Phaze_3
PWM_1_1: R36.2 TP41.1(G9) U7.41(PA8) U8.2(HIN) ; port PWM_1_1
PWM_1_2: R39.2 U7.34(PB13) U8.3(LIN) ; port PWM_1_2
PWM_2_1: R45.2 TP45.1(G9) U7.42(PA9) U9.2(HIN) ; port PWM_2_1
PWM_2_2: R46.2 U7.35(PB14) U9.3(LIN) ; port PWM_2_2
PWM_3_1: R23.2 TP19.1(G9) U1.2(HIN) U7.43(PA10) ; port PWM_3_1
PWM_3_2: R24.2 U1.3(LIN) U7.36(PB15) ; port PWM_3_2
PWR: P2.16 Q?#1.3(D) ; port PWR
PWR_LED: R28.1 ; port PWR_LED
PWR_ON_1: R?#13.2 U7.2(PC13-ANTI_TAMP) ; port PWR_ON_1
PWR_ON_2: P?.3 U7.3(PC14-OSC32_IN) ; port PWR_ON_2
PWR_ON_3: P?.5 U7.4(PC15-OSC32_OUT) ; port PWR_ON_3
PWR_ON_4: P?.7 U7.24(PC4) ; port PWR_ON_4
PWR_ON_5: P?.9 U7.25(PC5) ; port PWR_ON_5
RESET: R33.1 U7.7(NRST) ; port RESET
RST: P2.12 U7.26(PB0) ; port RST
RX: R?#2.1 TP?#7.1(G9) U7.59(PB7) U?#3.6(VOD) ; port RX
RX_2: P3.1 U7.37(PC6) ; port RX_2
SCK: P2.2 U7.55(PB3) ; port SCK
SCL: DD2.3(SCL1) P4.2 P5.2 P?.11 R65.1 U7.61(PB8) ; port SCL
SDA: DD2.2(SDA1) P4.3 P5.3 P?.13 R68.1 U7.62(PB9) ; port SDA
SWCLC: P1.3 U7.49(PA14) ; port SWCLC
SWDIO: P1.2 U7.46(PA13) ; port SWDIO
T_ADC: C52.1 R100.1 R103.2 U10.6(AIN2) ; port T_ADC
T_IRQ: P2.18 U7.8(PC0) ; port T_IRQ
TX: R?#3.1 TP?#5.1(G9) U7.58(PB6) U?#3.4(VIB) ; port TX
TX_2: P3.3 U7.38(PC7) ; port TX_2
V_1: R80.1 R83.2 TP55.1(G9) U7.17(PA3) ; port V_1
V_2: R78.1 R81.2 TP53.1(G9) U7.20(PA4) ; port V_2
V_3: R79.1 R82.2 TP54.1(G9) U7.21(PA5) ; port V_3
V_ADC: U10.4(AIN0) ; port V_ADC
V_FDB: C16.2(A) D11.1(C) D15.1(C) R101.2 TP29.1(G9) U4.1(Vin) ; port V_FDB
V_N: R109.1 R111.2 TP64.1(G9) U7.23(PA7) ; port V_N
Net*1_2: *1.2 U7.1(VBAT)
NetC6_1: C6.1 D1.1(C) TP10.1(G9) U1.8(VB)
NetC6_2: C6.2 D2.2(A) D9.1(C) L2.1 U1.6(VS) VT2.S VT3.D
NetC26_1: C26.1 D22.1(C) TP39.1(G9) U8.8(VB)
NetC26_2: C26.2 D23.2(A) D26.1(C) L5.1 U8.6(VS) VT4.S VT5.D
NetC28_1: C28.1 D27.1(C) TP43.1(G9) U9.8(VB)
NetC28_2: C28.2 D28.2(A) D31.1(C) L6.1 U9.6(VS) VT6.S VT7.D
NetC30_1: C30.1 R54.1 R55.2 R56.1
NetC41_1: C41.1 R90.1 U15.3(VIN+)
NetC42_1: C42.1 R91.2 U15.4(VIN-)
NetC44_1: C44.1 U7.5(PH0-OSC_IN) X1.2(X2)
NetC45_1: C45.1 U7.6(PH1-OSC_OUT) X1.1(X1)
NetC46_1: C46.1 U7.30(VCAP1)
NetCR1_1: CR1.1 L3.1 TP21.1(G9) U4.2(Output)
NetCR2_1: CR2.1 L4.1 TP26.1(G9) U5.2(Output)
NetD3_1: D3.1(C) R21.1 R22.2 TP13.1(G9)
NetD3_2: D3.2(A) R21.2 VT2.G
NetD4_1: D4.1(C) R25.1 R27.2 TP20.1(G9)
NetD4_2: D4.2(A) R27.1 VT3.G
NetD17_1: D17.1(A) R29.1
NetD18_1: D18.1(A) R30.1
NetD24_1: D24.1(C) R34.1 R35.2 TP40.1(G9)
NetD24_2: D24.2(A) R34.2 VT4.G
NetD25_1: D25.1(C) R41.1 R42.2 TP42.1(G9)
NetD25_2: D25.2(A) R42.1 VT5.G
NetD29_1: D29.1(C) R43.1 R44.2 TP44.1(G9)
NetD29_2: D29.2(A) R43.2 VT6.G
NetD30_1: D30.1(C) R47.1 R48.2 TP46.1(G9)
NetD30_2: D30.2(A) R48.1 VT7.G
NetD?#1_1: D?#1.1(A) R?#8.1 TP?#10.1(G9)
NetD?#2_1: D?#2.1(A) J?#2.2 R?#16.1 TP?#14.1(G9) VT?.D
NetD?#3_1: D?#3.1(A) R?#15.1 R?#22.2 TP?#13.1(G9) U?#4.1(VOUT)
NetD?#3_2: D?#3.2(K) R?#23.2 TP?#15.1(G9) VT?.G
NetD?#4_1: D?#4.1(A) R?#20.1
NetD?#5_1: D?#5.1(A) R?#21.1
NetD?#6_1: D?#6.1(A) R?#18.1
NetD?#7_1: D?#7.1(A) R?#19.1
NetDD2_6: DD2.6(SCL2) R67.1 R70.1 U10.10(SCL)
NetDD2_7: DD2.7(SDA2) R66.1 R69.1 U10.9(SDA)
NetJ?#1_1: J?#1.1 R?#1.1 TP?#6.1(G9) U?#2.6(A) Z?#1.1(K)
NetJ?#1_3: J?#1.3 R?#10.2 U?#2.7(B) Z?#2.1(K)
NetQ5_1: Q5.1(A) R53.2
NetQ5_3: Q5.3(E) R55.1
NetQ?#1_1: Q?#1.1(G) Q?#2.3(C) R?#12.2
NetQ?#2_1: Q?#2.1(B) R?#13.1 R?#14.1
NetR22_1: R22.1 U1.7(HO)
NetR25_2: R25.2 U1.5(LO)
NetR31_2: R31.2 RP1.3(CW)
NetR32_2: R32.2 RP2.3(CW)
NetR35_1: R35.1 U8.7(HO)
NetR41_2: R41.2 U8.5(LO)
NetR44_1: R44.1 U9.7(HO)
NetR47_2: R47.2 U9.5(LO)
NetR58_2: R58.2 TP47.1(G9) U11.3(OUT)
NetR59_2: R59.2 TP48.1(G9) U12.3(OUT)
NetR60_2: R60.2 TP49.1(G9) U13.3(OUT)
NetR64_1: R64.1 R69.2 R70.2 R71.2 U10.1(ADDR)
NetR72_1: R72.1 R75.2
NetR73_1: R73.1 R76.2
NetR74_1: R74.1 R77.2
NetR75_1: R75.1 R78.2
NetR76_1: R76.1 R79.2
NetR77_1: R77.1 R80.2
NetR98_2: R98.2 U7.60(BOOT0)
NetR106_1: R106.1 R107.2
NetR107_1: R107.1 R109.2
NetR108_2: R108.2 TP62.1(G9) U17.3(OUT)
NetR?#4_1: R?#4.1 R?#7.1 TP?#8.1(G9) U?#2.1(RO)
NetR?#5_1: R?#5.1 R?#6.1 TP?#3.1(G9) U?#2.4(DI)
NetR?#6_2: R?#6.2 U?#3.13(VOB)
NetR?#7_2: R?#7.2 U?#3.11(VID)
NetR?#9_2: R?#9.2 TP?#9.1(G9) U?#2.2(~{RE}) U?#2.3(DE) U?#3.12(VOC)
NetR?#17_2: R?#17.2(WIPER) TP?#16.1(G9) U?#4.4(VIN-)
NetRP1_2: RP1.2(WIPER) TP35.1(G9) U4.4(Feedback)
NetRP2_2: RP2.2(WIPER) TP36.1(G9) U5.4(Feedback)

Not connected (* = marked no-connect by the designer): MD1 1(GND) 2(3V3) 3(EN) 4(SENSOR_VP) 5(SENSOR_VN) 6(IO34) 7(IO35) 8(IO32) 9(IO33) 10(IO25) 11(IO26) 12(IO27) 13(IO14) 14(IO12) 15(GND) 16(IO13) 17(SD2) 18(SD3) 19(CMD) 20(CLK) 21(SD0) 22(SD1) 23(IO15) 24(IO2) 25(IO0) 26(IO4) 27(IO16) 28(IO17) 29(IO5) 30(IO18) 31(IO19) 32(NC) 33(IO21) 34(RXD0) 35(TXD0) 36(IO22) 37(IO23) 38(GND) 39(GND); P3 15 17; P? 8 10 12 14 15 16 17 18 19 20; U10 2(ALERT/RDY); U17 2(GND); U?#3 3(VIA) 14(VOA)

## Notes on the sheet
- (near J?#2) FAN
- (in symbol ACS758) VCC
- (in symbol CMP-04424-000193-1) +
- (in symbol CMP-12462-000027-1) +
- (in symbol MCP6001T) +; -